# EAGLE design lcd_arduino_alarm_clock (EAGLE 8.6.2)
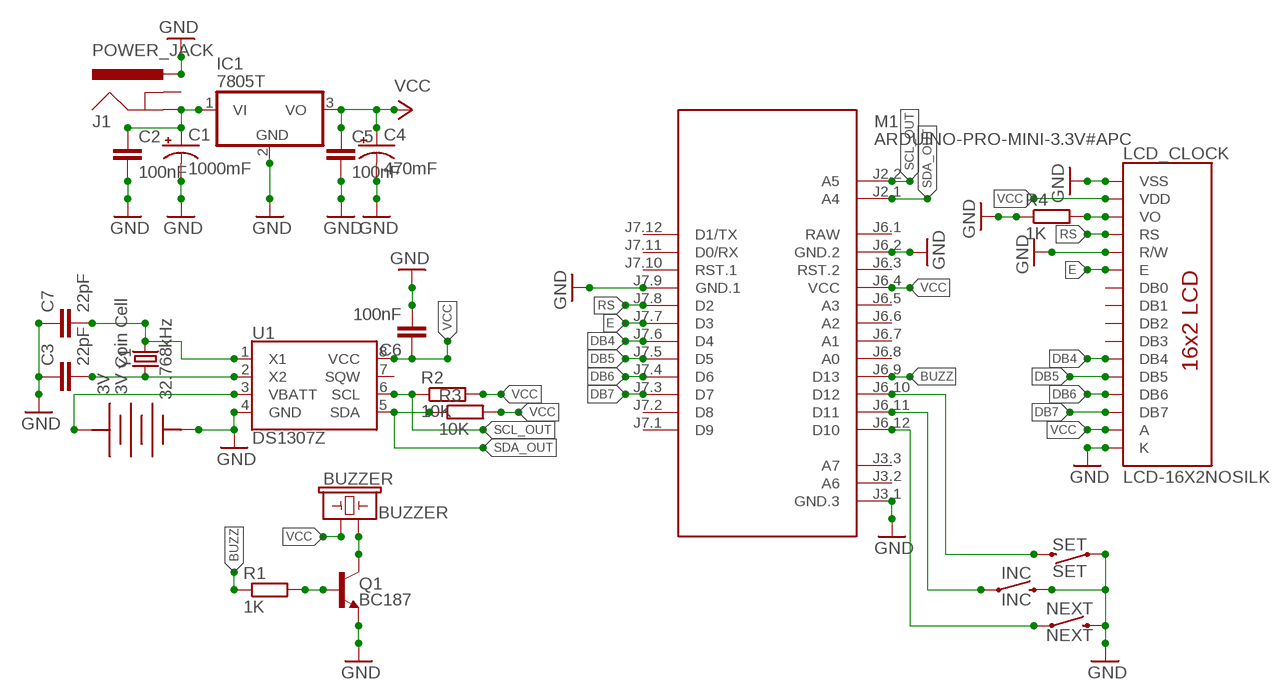
[diagram p0: schematic, sheet 1]

## Parts
3V  3V Coin Cell  FKIT-COIN_CELLLIR2450-H  [FKIT-LIR2450-H]
BUZZER  BUZZER  BUZZER-PTH  [BUZZER-12MM]
C1  1000mF  1000UF-RADIAL-5MM-25V-20%  [CPOL-RADIAL-5MM-10MM]
C2  100nF  100PF-0603-50V-5%  [0603]
C3  22pF  100PF-0603-50V-5%  [0603]
C4  470mF  1000UF-RADIAL-5MM-25V-20%  [CPOL-RADIAL-5MM-10MM]
C5  100nF  100PF-0603-50V-5%  [0603]
C6  100nF  100PF-0603-50V-5%  [0603]
C7  22pF  100PF-0603-50V-5%  [0603]
IC1  7805T  [TO220H]
INC  INC  MOMENTARY-SWITCH-SPST-PTH-6.0MM  [TACTILE_SWITCH_PTH_6.0MM]
J1  POWER_JACK  [POWER_JACK_PTH]
LCD_CLOCK  LCD-16X2NOSILK  [LCD-16X2_NOSILK]
M1  ARDUINO-PRO-MINI-3.3V#APC  [ARDUINO-PRO-MINI#APC]
NEXT  NEXT  MOMENTARY-SWITCH-SPST-PTH-6.0MM  [TACTILE_SWITCH_PTH_6.0MM]
Q1  BC187  TRANS_NPN-2N3904  [TO-92]
R1  1K  R-EU_0204/5  [0204/5]
R2  10K  R-EU_0204/5  [0204/5]
R3  10K  R-EU_0204/5  [0204/5]
R4  1K  R-EU_0204/5  [0204/5]
SET  SET  MOMENTARY-SWITCH-SPST-PTH-6.0MM  [TACTILE_SWITCH_PTH_6.0MM]
U1  DS1307Z  [SO08-0.15]
Y1  32.768kHz  CRYSTAL-32.768KHZPTH-2X6  [CRYSTAL-PTH-2X6-CYL]

## Nets
BUZZ: M1.J6.9(D13) R1.1
DB4: LCD_CLOCK.11(DB4) M1.J7.6(D4)
DB5: LCD_CLOCK.12(DB5) M1.J7.5(D5)
DB6: LCD_CLOCK.13(DB6) M1.J7.4(D6)
DB7: LCD_CLOCK.14(DB7) M1.J7.3(D7)
E: LCD_CLOCK.6(E) M1.J7.7(D3)
GND: 3V.NEG C1.- C2.2 C3.1 C4.- C5.2 C6.2 C7.1 IC1.2(GND) INC.3 J1.PWR LCD_CLOCK.1(VSS) LCD_CLOCK.5(R/W) LCD_CLOCK.16(K) M1.J3.1(GND.3) M1.J6.2(GND.2) M1.J7.9(GND.1) NEXT.3 Q1.1(E) R4.1 SET.1 U1.4(GND)
N$1: C1.+ C2.1 IC1.1(VI) J1.GND
N$2: LCD_CLOCK.3(VO) R4.2
N$3: C3.2 U1.2(X2) Y1.1
N$4: 3V.POS U1.3(VBATT)
N$5: Q1.2(B) R1.2
N$6: M1.J6.10(D12) SET.3
N$7: INC.1 M1.J6.11(D11)
N$8: M1.J6.12(D10) NEXT.1
N$9: BUZZER.- Q1.3(C)
N$11: C7.2 U1.1(X1) Y1.2
RS: LCD_CLOCK.4(RS) M1.J7.8(D2)
SCL_OUT: M1.J2.2(A5) R2.1 U1.6(SCL)
SDA_OUT: M1.J2.1(A4) R3.1 U1.5(SDA)
VCC: BUZZER.+ C4.+ C5.1 C6.1 IC1.3(VO) LCD_CLOCK.2(VDD) LCD_CLOCK.15(A) M1.J6.4(VCC) R2.2 R3.2 U1.8(VCC)
Unconnected: J1.GNDBREAK LCD_CLOCK.7(DB0) LCD_CLOCK.8(DB1) LCD_CLOCK.9(DB2) LCD_CLOCK.10(DB3) M1.J3.2(A6) M1.J3.3(A7) M1.J6.3(RST.2) M1.J6.5(A3) M1.J6.6(A2) M1.J6.7(A1) M1.J6.8(A0) M1.J7.1(D9) M1.J7.2(D8) M1.J7.10(RST.1) M1.J7.11(D0/RX) M1.J7.12(D1/TX) U1.7(SQW)

## Power pins joined to a net without a drawn wire
RAW: M1.J6.1(RAW)

## Library data of the parts
3V = SparkFun-Retired:FKIT-COIN_CELL: Fabrick.it Coin Cell Holder Coin cell holder for 24.5mm rechargable coin cell
BUZZER = SparkFun-Electromechanical:BUZZER: Buzzer Small round buzzers that operate around the audible 2kHz range. You can use these as speakers to create simple music or user interfaces. Variant Overview: PTH - Mini Speaker - PC Mount 12mm 2.048kHz <https://www.sparkfun.com/products/7950> PTH_KIT - Mini Speaker - PC Mount 12mm 2.048kHz <https://www.sparkfun.com/products/7950> KIT simplifies soldering by adding stop mask to one side of the pads. PTH_NO_SILK - Mini Speaker - PC Mount 12mm 2.048kHz <https://www.sparkfun.com/products/7950> No silkscreen indicator of buzzer outline. PTH_KIT_NO_SILK - Mini Speaker - PC Mount 12mm 2.048kHz <https://www.sparkfun.com/products/7950> KIT package w/o silkscreen SMD - Buzzer Audio Magnetic (CCV-084B16) SMD buzzer used on, e.g. the LilyPad Buzzer <https://www.sparkfun.com/products/8463> and RFID USB Reader <https://www.sparkfun.com/products/9963>. SMD_KIT - Buzzer Audio Magnetic (CCV-084B16) SMD Buzzer with elongated pins to make soldering easier. Used on the SparkFun Simon Says - Surface Mount Soldering Kit <https://www.sparkfun.com/products/10935>.; PROD_ID: COMP-08253; SF_SKU: COM-07950
C1 C4 = SparkFun-Capacitors:1000UF: 1,000µF/1mF ceramic capacitors A capacitor is a passive two-terminal electrical component used to store electrical energy temporarily in an electric field. CAP-08070; PROD_ID: CAP-09538; VALUE: 1mF
C2 C3 C5-C7 = SparkFun-Capacitors:100PF: 100pF/0.1nF ceramic capacitors A capacitor is a passive two-terminal electrical component used to store electrical energy temporarily in an electric field.; PROD_ID: CAP-07883; VALUE: 100pF
IC1 = linear:78*: Positive VOLTAGE REGULATOR Source: http://cache.national.com/ds/LM/LM78L05.pdf http://www.fairchildsemi.com/ds/LM/LM7805.pdf
INC NEXT SET = SparkFun-Switches:MOMENTARY-SWITCH-SPST: Momentary Switch (Pushbutton) - SPST Normally-open (NO) SPST momentary switches (buttons, pushbuttons). Variants PTH-12MM - 12mm square, through-hole Momentary Pushbutton Switch - 12mm Square <https://www.sparkfun.com/products/9190> (COM-09190) PTH-6.0MM, PTH-6.0MM-KIT - 6.0mm square, through-hole Mini Pushbutton Switch <https://www.sparkfun.com/products/97> (COM-00097) KIT package intended for soldering kit's - only one side of pads' copper is exposed. PTH-RIGHT-ANGLE-KIT - Right-angle, through-hole Right Angle Tactile Button <https://www.sparkfun.com/products/10791> - Used on SparkFun BigTime Watch Kit <https://www.sparkfun.com/products/11734> SMD-12MM - 12mm square, surface-mount Tactile Button - SMD (12mm) <https://www.sparkfun.com/products/12993> (COM-12993) Used on SparkFun PicoBoard <https://www.sparkfun.com/products/11888> SMD-4.5MM - 4.5mm Square Trackball Switch Used on SparkFun Blackberry Trackballer Breakout <https://www.sparkfun.com/products/13169> SMD-4.6MMX2.8MM - 4.60mm x 2.80mm, surface mount Used on SparkFun SAMD21 Mini Breakout <https://www.sparkfun.com/products/13664> SMD-5.2MM, SMD-5.2-REDUNDANT - 5.2mm square, surface-mount Mini Pushbutton Switch - SMD <https://www.sparkfun.com/products/8720> (COM-08720) Used on Arduino Pro Mini <https://www.sparkfun.com/products/11114> REDUNDANT package connects both switch circuits together SMD-6.0X3.5MM - 6.0 x 3.5mm, surface mount Momentary Reset Switch SMD <https://www.sparkfun.com/products/8229> (COM-08229) SMD-6.2MM-TALL - 6.2mm square, surface mount Tactile Button - SMD (6mm) <https://www.sparkfun.com/products/12992> Used on SparkFun Digital Sandbox <https://www.sparkfun.com/products/12651> SMD-RIGHT-ANGLE - Right-angle, surface mount Used on SparkFun Block for Intel® Edison - Arduino <https://www.sparkfun.com/products/13036>; PROD_ID: SWCH-08441; SF_SKU: COM-00097
J1 = SparkFun-Connectors:POWER_JACK: Power Jack Connector This is the standard 5.5mm barrel jack for power. The PTH is the most common, proven, reliable, footprint. The Slot footprint only works if the mill layer is transmitted to the PCB fab house so be warned. Here are the connectors we sell at SparkFun: DC Barrel Power Jack/Connector <https://www.sparkfun.com/products/119> (PRT-00119) DC Barrel Power Jack/Connector (SMD) <https://www.sparkfun.com/products/12748> (PRT-12748) DC Barrel Jack Adapter - Breadboard Compatible <https://www.sparkfun.com/products/10811> (PRT-10811) It is used on this SparkFun product (and many, many others): SparkFun RedBoard - Programmed with Arduino <https://www.sparkfun.com/products/12757> (DEV-12757) Also, if you need a mating power supply or connector, please check these out: Wall Adapter Power Supply - 9VDC 650mA <https://www.sparkfun.com/products/298> (TOL-00298) DC Barrel Jack Adapter - Male <https://www.sparkfun.com/products/10287> (PRT-10287); PROD_ID: CONN-08197
LCD_CLOCK = SparkFun-Displays:LCD-16X2: Standard text-only 16x2 parallel input LCD Basic 16 character by 2 line display. Typically utilizes the extremely common HD44780 parallel interface chipset SparkFun Products: Basic 16x2 Green <https://www.sparkfun.com/products/255> Basic 8x2 Green <https://www.sparkfun.com/products/11122>; SF_ID: LCD-00255
M1 = diy-modules:ARDUINO-PRO-MINI-*#APC: Arduino Pro Mini (and compatible devices) with angle programming connector More details available here: https://www.arduino.cc/en/Main/ArduinoBoardProMini Click here to find device on ebay.com <http://www.ebay.com/sch/arduino+pro+mini>
Q1 = SparkFun-DiscreteSemi:TRANS_NPN: NPN transistor Current controlled devices typically used to amplify current or used as a switch. BC547 - COM-08928 <http://www.sparkfun.com/products/8928> (TO-92 45V 100mA) (1.Collector 2.Base 3.Emitter) 2N3904 - COM-00521 <http://www.sparkfun.com/products/521> (TO-92 40V 200mA) (1.Emitter 2.Base 3.Collector) P2N2222A - COM-12852 <http://www.sparkfun.com/products/12852> (TO-92 40V 600mA) (1.Collector 2.Base 3.Emitter); PROD_ID: TRANS-08447; VALUE: 200mA/40V
R1-R4 = rcl:R-EU_: RESISTOR, European symbol; SPICEPREFIX: R
U1 = SparkFun-Clocks:DS1307: Maxim DS1307 - I2C Real-time clock (RTC) The DS1307 serial real-time clock (RTC) is a low-power, full binary-coded decimal (BCD) clock/calendar plus 56 bytes of NV SRAM. Address and data are transferred serially through an I2C, bidirectional bus. The clock/calendar provides seconds, minutes, hours, day, date, month, and year information. SparkFun Products: Real Time Clock Module <https://www.sparkfun.com/products/12708> (BOB-12708) Datasheet <https://cdn.sparkfun.com/datasheets/BreakoutBoards/DS1307.pdf>; PROD_ID: IC-08138
Y1 = SparkFun-Clocks:CRYSTAL-32.768KHZ: 32.768kHz Crystal Frequency: 32.768kHz Frequency Stability: ±20ppm Load Capacitance: 12.5pF (PTH-2X6 & SMD-3.2X1.5), 6pF (SMD-2X6) SparkFun Products: SparkFun BigTime Watch Kit <https://www.sparkfun.com/products/11734> SparkFun nRF52832 Breakout <https://www.sparkfun.com/products/13990> SparkFun Real Time Clock Module <https://www.sparkfun.com/products/12708>; PROD_ID: XTAL-10112

## Board
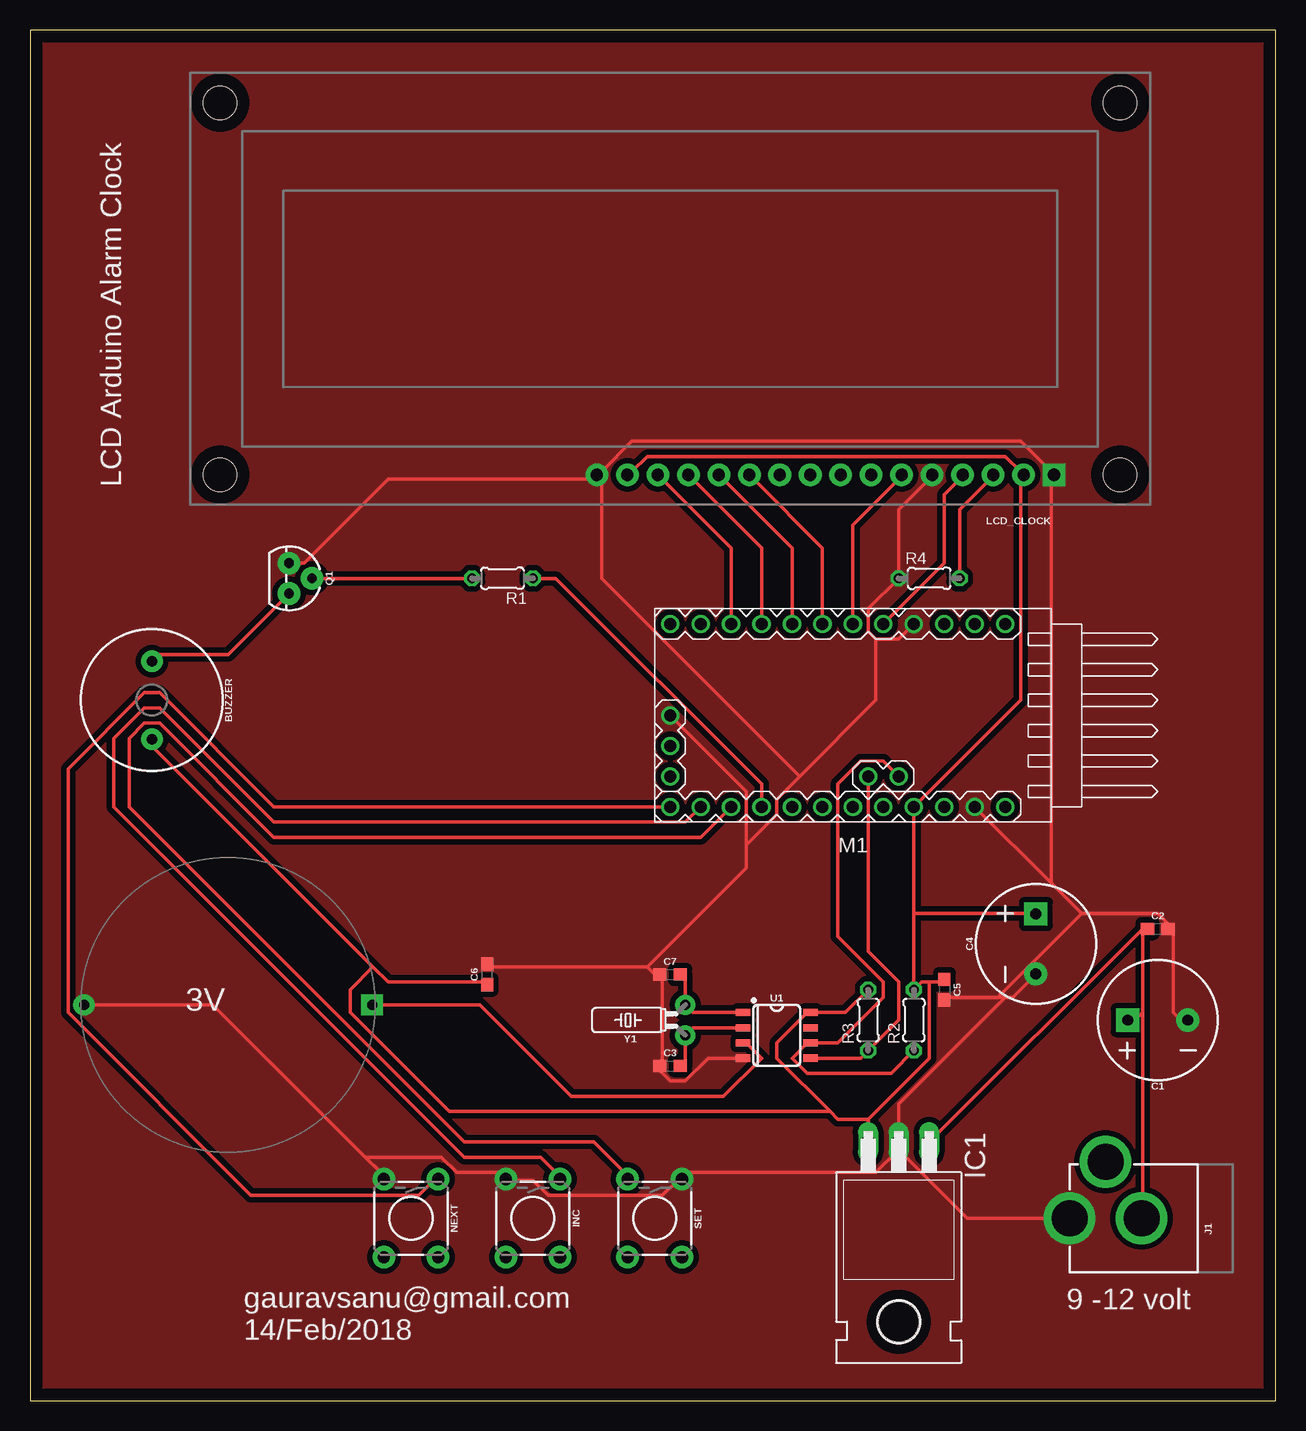
[diagram p1: board, top side]

Size 103.81 x 114.29 mm. Coordinates in mm from the lower left corner, seen from the top.
Outline: 0,0 103.81,0 103.81,114.29 0,114.29 0,0
Copper layers (1*16): Top 0.035mm / dielectric 1.5mm / Bottom 0.035mm
Design rules "default *": minimum track width 12mil, minimum drill 0.35mm, track to track 18mil, track to pad 10mil, pad to pad 6mil, via to via 6mil, smd to smd 6mil, copper to edge 40mil, drill to drill 6mil, minimum pad ring 10mil, minimum via ring 8mil, stop-mask expansion 4mil, vias tented up to drill 0mil, thermal gap 10mil

### Footprints (pad centres in the part's own frame; a part is rotated, then mirrored left to right if it is on the bottom)
FKIT-LIR2450-H = drill 0.85 pad 1.778: NEG -12,0 | drill 0.85 pad 1.778 square: POS 12,0
BUZZER-12MM = drill 0.9 pad 1.778: + 3.25,0; - -3.25,0
CPOL-RADIAL-5MM-10MM = drill 0.9 pad 1.93 square: + 2.5,0 | drill 0.9 pad 1.93: - -2.5,0
0603 = smd 1.1 x 1: 1 -0.85,0; 2 0.85,0
TO220H = drill 1.118 long: 1 -2.54,-10.16; 2 0,-10.16; 3 2.54,-10.16 | hole 3.302: 0,4.826
TACTILE_SWITCH_PTH_6.0MM = drill 1.016 pad 1.88: 1 -3.251,2.261; 2 3.251,2.261; 3 -3.251,-2.261; 4 3.251,-2.261
POWER_JACK_PTH = drill 2.997 pad 4.318: GND 0,7.7; GNDBREAK 4.7,10.7; PWR 0,13.7
LCD-16X2_NOSILK = drill 1.016 pad 1.88 square: 1 -32,15.5 | drill 1.016 pad 1.88: 2 -29.46,15.5; 3 -26.92,15.5; 4 -24.38,15.5; 5 -21.84,15.5; 6 -19.3,15.5; 7 -16.76,15.5; 8 -14.22,15.5; 9 -11.68,15.5; 10 -9.14,15.5; 11 -6.6,15.5; 12 -4.06,15.5; 13 -1.52,15.5; 14 1.02,15.5; 15 3.56,15.5; 16 6.1,15.5 | hole 2.8: -37.5,15.5; -37.5,-15.5; 37.5,15.5; 37.5,-15.5
ARDUINO-PRO-MINI#APC = drill 1: J2.1 -1.27,5.08; J2.2 -3.81,5.08; J3.1 15.24,0; J3.2 15.24,2.54; J3.3 15.24,5.08; J6.1 -12.7,7.62; J6.2 -10.16,7.62; J6.3 -7.62,7.62; J6.4 -5.08,7.62; J6.5 -2.54,7.62; J6.6 0,7.62; J6.7 2.54,7.62; J6.8 5.08,7.62; J6.9 7.62,7.62; J6.10 10.16,7.62; J6.11 12.7,7.62; J6.12 15.24,7.62; J7.1 15.24,-7.62; J7.2 12.7,-7.62; J7.3 10.16,-7.62; J7.4 7.62,-7.62; J7.5 5.08,-7.62; J7.6 2.54,-7.62; J7.7 0,-7.62; J7.8 -2.54,-7.62; J7.9 -5.08,-7.62; J7.10 -7.62,-7.62; J7.11 -10.16,-7.62; J7.12 -12.7,-7.62
TO-92 = drill 0.813 pad 1.88: 1 -1.27,0; 2 0,1.905; 3 1.27,0
0204/5 = drill 0.813 octagon: 1 -2.54,0; 2 2.54,0
SO08-0.15 = smd 0.6 x 1.2: 1 -1.905,-2.8; 2 -0.635,-2.8; 3 0.635,-2.8; 4 1.905,-2.8; 5 1.905,2.8; 6 0.635,2.8; 7 -0.635,2.8; 8 -1.905,2.8
CRYSTAL-PTH-2X6-CYL = drill 0.813 pad 1.676: 1 -1.27,0; 2 1.27,0

### Placement (x,y rotation side)
3V  16.51,33.02 0 top
BUZZER  10.16,58.42 270 top
C1  93.98,31.75 180 top
C2  93.98,39.37 0 top
C3  53.34,27.94 0 top
C4  83.82,38.1 90 top
C5  76.2,34.29 270 top
C6  38.1,35.56 90 top
C7  53.34,35.56 0 top
IC1  72.39,11.43 180 top
INC  41.91,15.24 270 top
J1  100.33,15.24 90 top
LCD_CLOCK  53.34,92.71 180 top
M1  68.58,57.15 180 top
NEXT  31.75,15.24 270 top
Q1  21.59,68.58 270 top
R1  39.37,68.58 180 top
R2  73.66,31.75 90 top
R3  69.85,31.75 90 top
R4  74.93,68.58 0 top
SET  52.07,15.24 270 top
U1  62.23,30.48 270 top
Y1  54.61,31.75 90 top

### Tracks (layer width: path | path; a pad name or v marks a point on that pad's centre or on a via)
BUZZ
  Top 0.305: R1.1 43.82,68.58 60.96,51.43 M1.J6.9
DB4
  Top 0.305: M1.J7.6 66.04,71.12 60.33,76.83 LCD_CLOCK.11
DB5
  Top 0.305: M1.J7.5 63.5,71.12 57.79,76.83 LCD_CLOCK.12
DB6
  Top 0.305: M1.J7.4 60.96,71.12 55.25,76.83 LCD_CLOCK.13
DB7
  Top 0.305: M1.J7.3 58.42,71.12 52.71,76.83 LCD_CLOCK.14
E
  Top 0.305: M1.J7.7 68.58,73.02 72.39,76.83 LCD_CLOCK.6
GND
  Top 0.305: Q1.1 22.86,69.85 29.84,76.83 46.99,76.83 LCD_CLOCK.16 | LCD_CLOCK.5 74.93,76.83 72.39,74.3 R4.1 69.85,66.04 69.85,64.14 70.48,63.5 | M1.J7.9 72.39,63.5 70.48,63.5 | 51.44,36.2 38.1,36.2 C6.2 | 51.44,36.2 52.07,35.56 C7.1 52.71,35.56 52.71,27.94 C3.1 52.07,27.94 53.34,26.67 54.61,26.67 56.52,28.58 U1.4 | M1.J3.1 59.69,50.8 59.69,46.35 | 59.69,46.35 59.69,44.45 51.44,36.2 | 70.48,63.5 70.48,58.42 64.14,52.07 | 64.14,52.07 62.23,50.16 62.23,48.89 59.69,46.35 | 64.14,52.07 47.62,68.58 47.62,76.83 LCD_CLOCK.16 | 95.25,39.37 95.25,32.38 95.89,31.75 C1.- | 87.63,40.64 85.09,43.18 | 85.09,43.18 M1.J6.2 | 87.63,40.64 93.98,40.64 95.25,39.37 | 95.25,39.37 C2.2 | 85.09,43.18 85.09,76.83 LCD_CLOCK.1 85.09,77.47 82.55,80.01 50.16,80.01 47.62,77.47 LCD_CLOCK.16 | 3V.NEG 15.24,33.02 27.94,20.32 | 27.94,20.32 29.21,19.05 NEXT.3 | 27.94,20.32 34.29,20.32 35.56,19.05 39.37,19.05 INC.3 40.01,18.41 41.91,18.41 43.18,17.14 52.71,17.14 53.98,18.41 SET.1 54.61,19.05 70.48,19.05 72.39,20.95 | 81.28,33.66 81.92,33.66 83.82,35.56 C4.- | 81.28,33.66 80.64,33.66 | 80.64,33.66 76.2,33.66 C5.2 | 81.28,33.66 72.39,24.77 IC1.2 72.39,20.95 | J1.PWR 78.11,15.24 72.39,20.95 | 80.64,33.66 87.63,40.64
  pour Top (isolate 0.254, no thermals): 0,114.3 104.14,114.3 104.14,0 0,0
N$1
  Top 0.305: 92.71,32.38 92.71,39.37 | 92.71,32.38 92.08,31.75 C1.+ | 92.71,39.37 IC1.1 | 92.71,39.37 C2.1 | 92.71,32.38 92.71,15.24 J1.GND
N$2
  Top 0.305: R4.2 77.47,74.3 80.01,76.83 LCD_CLOCK.3
N$3
  Top 0.305: C3.2 54.61,27.94 Y1.1 55.25,31.12 U1.2
N$4
  Top 0.305: 3V.POS 37.47,33.02 45.09,25.4 57.79,25.4 60.96,28.58 59.69,29.84 U1.3
N$5
  Top 0.305: Q1.2 R1.2
N$6
  Top 0.305: M1.J6.10 55.88,46.99 20.32,46.99 10.79,56.52 9.53,56.52 8.26,55.24 8.26,49.53 36.2,21.59 46.99,21.59 49.53,19.05 SET.3
N$7
  Top 0.305: M1.J6.11 54.61,48.26 20.32,48.26 10.79,57.78 9.53,57.78 6.98,55.24 6.98,49.53 36.2,20.32 42.55,20.32 43.82,19.05 INC.1
N$8
  Top 0.305: M1.J6.12 20.32,49.53 10.79,59.05 9.53,59.05 3.17,52.7 3.17,32.38 18.41,17.14 32.38,17.14 33.66,18.41 NEXT.1
N$9
  Top 0.305: Q1.3 16.51,62.23 10.16,62.23 BUZZER.-
N$11
  Top 0.305: C7.2 54.61,35.56 Y1.2 55.25,32.38 U1.1
RS
  Top 0.305: M1.J7.8 76.2,69.85 76.2,75.56 77.47,76.83 LCD_CLOCK.4
SCL_OUT
  Top 0.305: R2.1 71.75,27.3 64.77,27.3 63.5,28.58 64.77,29.84 U1.6 67.31,29.84 71.12,33.66 71.12,34.92 67.31,38.73 67.31,51.43 69.22,53.34 71.12,53.34 M1.J2.2
SDA_OUT
  Top 0.305: U1.5 69.22,28.58 R3.1 72.39,31.75 72.39,34.92 69.85,37.46 M1.J2.1
VCC
  Top 0.305: 28.57,36.2 10.16,54.61 BUZZER.+ | 28.57,36.2 29.84,34.92 38.1,34.92 C6.1 | LCD_CLOCK.15 50.16,77.47 51.44,78.74 81.28,78.74 82.55,77.47 LCD_CLOCK.2 82.55,76.83 82.55,58.42 M1.J6.4 73.66,40.64 | R3.2 67.95,32.38 U1.8 64.77,32.38 62.23,29.84 62.23,28.58 66.67,24.13 | 74.93,34.92 74.3,34.92 R2.2 73.66,40.64 | 74.93,34.92 76.2,34.92 C5.1 | 69.85,23.49 IC1.3 | 69.85,23.49 74.93,28.58 74.93,34.92 | 73.66,40.64 83.82,40.64 C4.+ | 66.67,24.13 67.31,23.49 69.85,23.49 | 28.57,36.2 26.67,34.29 26.67,32.38 34.92,24.13 66.67,24.13

### Text on the board
tPlace: LCD Arduino Alarm Clock | 9 -12 volt | gauravsanu@gmail.com / 14/Feb/2018